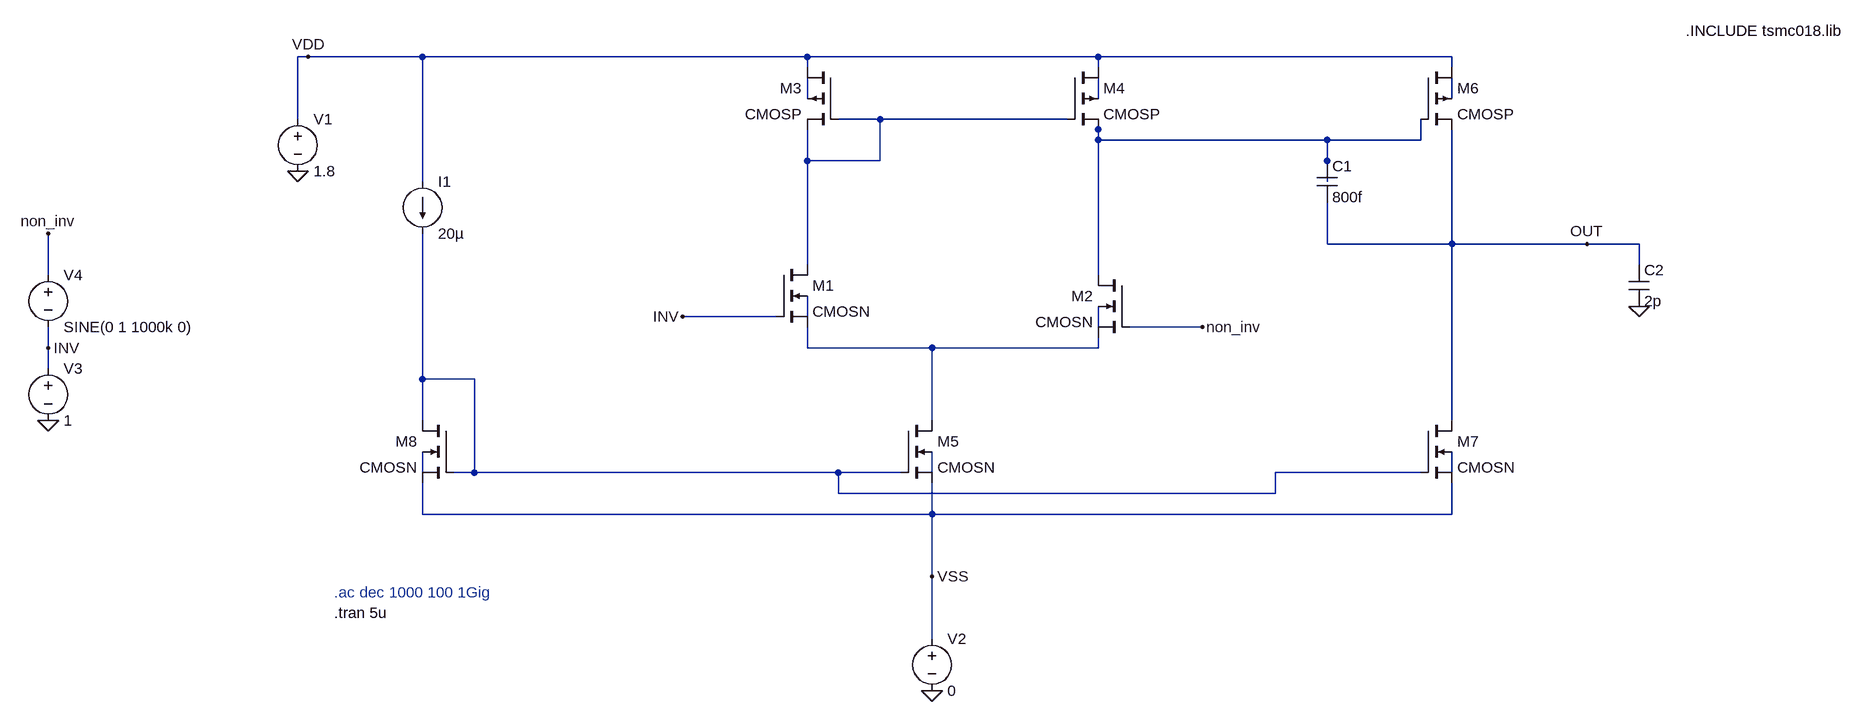
[diagram p0: schematic DIfferential Amplifier.asc]
DIfferential Amplifier.asc, the LTspice schematic file:
Version 4
SHEET 1 2188 1016
WIRE -192 -16 -208 -16
WIRE -16 -16 -192 -16
WIRE 576 -16 -16 -16
WIRE 1024 -16 576 -16
WIRE 1568 -16 1024 -16
WIRE 576 0 576 -16
WIRE 1024 0 1024 -16
WIRE 1568 0 1568 -16
WIRE 576 48 576 16
WIRE 1024 48 1024 16
WIRE 1568 48 1568 16
WIRE -208 80 -208 -16
WIRE 688 80 624 80
WIRE 976 80 688 80
WIRE 1024 96 1024 80
WIRE 1024 112 1024 96
WIRE 1376 112 1024 112
WIRE 1520 112 1520 80
WIRE 1520 112 1376 112
WIRE 576 144 576 96
WIRE 688 144 688 80
WIRE 688 144 576 144
WIRE 1376 144 1376 112
WIRE -16 176 -16 -16
WIRE 1376 176 1376 144
WIRE 1376 272 1376 208
WIRE 1568 272 1568 96
WIRE 1568 272 1376 272
WIRE 1776 272 1568 272
WIRE 1856 272 1776 272
WIRE 576 304 576 144
WIRE 1856 304 1856 272
WIRE -592 320 -592 256
WIRE 1024 320 1024 112
WIRE 528 384 384 384
WIRE 576 384 576 352
WIRE 1024 400 1024 368
WIRE 1184 400 1072 400
WIRE -592 432 -592 400
WIRE 576 432 576 400
WIRE 768 432 576 432
WIRE 1024 432 1024 416
WIRE 1024 432 768 432
WIRE -592 464 -592 432
WIRE -16 480 -16 256
WIRE 64 480 -16 480
WIRE -16 544 -16 480
WIRE 768 544 768 432
WIRE 1568 544 1568 272
WIRE -16 624 -16 592
WIRE 64 624 64 480
WIRE 64 624 32 624
WIRE 624 624 64 624
WIRE 720 624 624 624
WIRE 768 624 768 592
WIRE 1520 624 1296 624
WIRE 1568 624 1568 592
WIRE 624 656 624 624
WIRE 1296 656 1296 624
WIRE 1296 656 624 656
WIRE -16 688 -16 640
WIRE 768 688 768 640
WIRE 768 688 -16 688
WIRE 1568 688 1568 640
WIRE 1568 688 768 688
WIRE 768 784 768 688
WIRE 768 880 768 784
FLAG -208 160 0
FLAG 1856 368 0
FLAG -192 -16 VDD
FLAG 384 384 INV
FLAG 768 784 VSS
FLAG 1776 272 OUT
FLAG 1184 400 non_inv
FLAG -592 544 0
FLAG -592 432 INV
FLAG -592 256 non_inv
FLAG 768 960 0
SYMBOL voltage -208 64 R0
SYMATTR InstName V1
SYMATTR Value 1.8
SYMBOL current -16 176 R0
WINDOW 123 0 0 Left 0
WINDOW 39 0 0 Left 0
SYMATTR InstName I1
SYMATTR Value 20µ
SYMBOL pmos4 624 0 M0
SYMATTR InstName M3
SYMATTR Value2 l=500n w=7u
SYMATTR Value CMOSP
SYMBOL pmos4 976 0 R0
SYMATTR InstName M4
SYMATTR Value2 l=500n w=7u
SYMATTR Value CMOSP
SYMBOL pmos4 1520 0 R0
SYMATTR InstName M6
SYMATTR Value2 l=500n w=87u
SYMATTR Value CMOSP
SYMBOL cap 1360 144 R0
SYMATTR InstName C1
SYMATTR Value 800f
SYMBOL cap 1840 304 R0
SYMATTR InstName C2
SYMATTR Value 2p
SYMBOL nmos4 32 544 M0
SYMATTR InstName M8
SYMATTR Value2 l=1u w=20u
SYMATTR Value CMOSN
SYMBOL nmos4 528 304 R0
SYMATTR InstName M1
SYMATTR Value2 l=500n w=4.5u
SYMATTR Value CMOSN
SYMBOL nmos4 1072 320 M0
SYMATTR InstName M2
SYMATTR Value2 l=500n w=4.5u
SYMATTR Value CMOSN
SYMBOL nmos4 720 544 R0
SYMATTR InstName M5
SYMATTR Value2 l=1u w=20u
SYMATTR Value CMOSN
SYMBOL nmos4 1520 544 R0
SYMATTR InstName M7
SYMATTR Value2 l=1u w=125u
SYMATTR Value CMOSN
SYMBOL voltage -592 448 R0
WINDOW 123 0 0 Left 0
WINDOW 39 0 0 Left 0
SYMATTR InstName V3
SYMATTR Value 1
SYMBOL voltage -592 304 R0
WINDOW 123 24 124 Left 2
WINDOW 39 0 0 Left 0
SYMATTR InstName V4
SYMATTR Value SINE(0 1 1000k 0)
SYMBOL voltage 768 864 R0
WINDOW 123 0 0 Left 0
WINDOW 39 0 0 Left 0
SYMATTR InstName V2
SYMATTR Value 0
TEXT -152 808 Left 2 ;.ac dec 1000 100 1Gig
TEXT 1928 -56 Left 2 !.INCLUDE tsmc018.lib
TEXT -152 840 Left 2 !.tran 5u

The netlist it stands for:
* DIfferential Amplifier.asc
V1 VDD 0 1.8
I1 VDD N009 20µ
M3 VDD N004 N004 N001 CMOSP l=500n w=7u
M4 VDD N004 N005 N002 CMOSP l=500n w=7u
M6 VDD N005 OUT N003 CMOSP l=500n w=87u
C1 N005 OUT 800f
C2 OUT 0 2p
M8 N009 N009 VSS N010 CMOSN l=1u w=20u
M1 N004 INV N008 N006 CMOSN l=500n w=4.5u
M2 N005 non_inv N008 N007 CMOSN l=500n w=4.5u
M5 N008 N009 VSS N011 CMOSN l=1u w=20u
M7 OUT N009 VSS N012 CMOSN l=1u w=125u
V3 INV 0 1
V4 non_inv INV SINE(0 1 1000k 0)
V2 VSS 0 0
.model NMOS NMOS
.model PMOS PMOS
.lib standard.mos
* .ac dec 1000 100 1Gig
.INCLUDE tsmc018.lib
.tran 5u
.backanno
.end